# Altium schematic sheet pwm.SchDoc
size A4
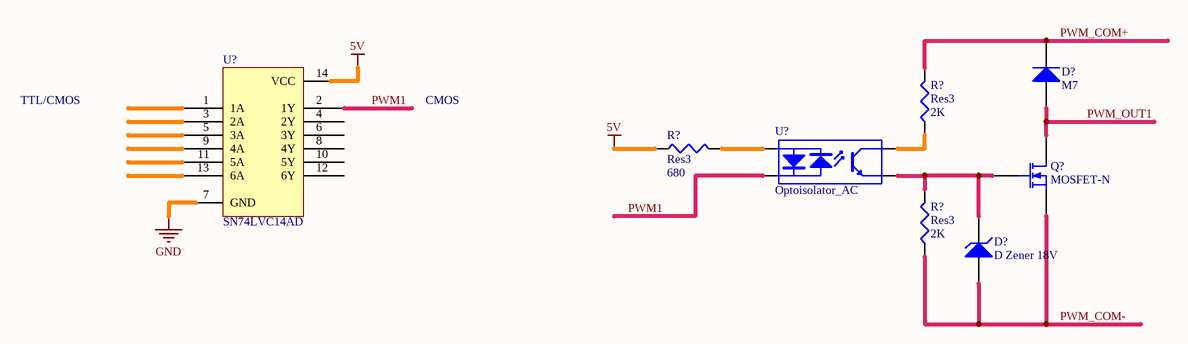
[diagram p0: pwm.SchDoc]

## Parts
(Parts that share a designator on the sheet are numbered #1, #2 ... from top to bottom, then left to right.)
D?#1  M7  [SMC]
D?#2  D Zener 18V  [DIODE-0.7]
Q?  MOSFET-N  [E3]
R?#1  Res3  value 2K  [J1-0603]
R?#2  Res3  value 680  [J1-0603]
R?#3  Res3  value 2K  [J1-0603]
U?#1  SN74LVC14AD  [SOIC-14]
U?#2  Optoisolator_AC

## Nets
5V: R?#2.1 U?#1.14(VCC)
GND: U?#1.7(GND)
PWM1: U?#1.2(1Y) U?#2.2(K)
PWM_COM+: D?#1.2(K) R?#1.2
PWM_COM-: D?#2.1(A) Q?.3(S) R?#3.1
PWM_OUT1: D?#1.1(A) Q?.1(D)
NetD?#2_2: D?#2.2(K) Q?.2(G) R?#3.2 U?#2.3(E)
NetR?#1_1: R?#1.1 U?#2.4(C)
NetR?#2_2: R?#2.2 U?#2.1(A)

Not connected (* = marked no-connect by the designer): U?#1 1(1A) 3(2A) 4(2Y) 5(3A) 6(3Y) 8(4Y) 9(4A) 10(5Y) 11(5A) 12(6Y) 13(6A)

## Notes on the sheet
- TTL/CMOS
- CMOS

## Library data of the parts
D?#1 = Diode: Default Diode; Published: 8-Jun-2000; LatestRevisionDate: 17-Jul-2002; LatestRevisionNote: Re-released for DXP Platform.; PackageVersion: Sep-1996; PackageReference: SMC; Publisher: Altium Limited; PackageDescription: DO-214-AB/SMC; 2 C-Bend Leads; Body 7.9 x 5.9 mm, inc. leads (LxW); Code_JEDEC: DO-214-AB
D?#2 = D Zener: Zener Diode; Published: 8-Jun-2000; LatestRevisionDate: 17-Jul-2002; LatestRevisionNote: Re-released for DXP Platform.; PackageReference: DIODE-0.7; Publisher: Altium Limited; PackageDescription: Diode, Thru-Hole; 2 Leads; 0.7 in Pin Spacing
Q? = MOSFET-N: N-Channel MOSFET; Published: 8-Jun-2000; LatestRevisionDate: 17-Jul-2002; LatestRevisionNote: Re-released for DXP Platform.; PackageVersion: 1995/1996; PackageReference: E3; Publisher: Altium Limited; PackageDescription: TO, Flat Index; 3 In-Line, Axial Leads; Body Dia. 4.6mm; Lead Dia. 0.5 mm (max)
R?#1-R?#3 = Res3: Resistor; Published: 8-Jun-2000; LatestRevisionDate: 29-May-2009; LatestRevisionNote: IPC-7351 Footprint Added.; PackageReference: J1-0603; Publisher: Altium Limited; PackageDescription: Chip Resistor
U?#1 = SN74LVC240ADBLE: SNx4LVC14A Hex Schmitt-Trigger Inverters; Mfg: TI; Mfg P/N: SN74LVC14AD; HelpURL: http://www.ti.com.cn/cn/lit/ds/symlink/sn74lvc14a.pdf
U?#2 = Optoisolator_AC: 4-Pin Phototransistor Optocoupler; HelpURL: http://www.cel.com/pdf/datasheets/ps2705a1.pdf